# EAGLE design lofisampler (EAGLE 9.1.3)
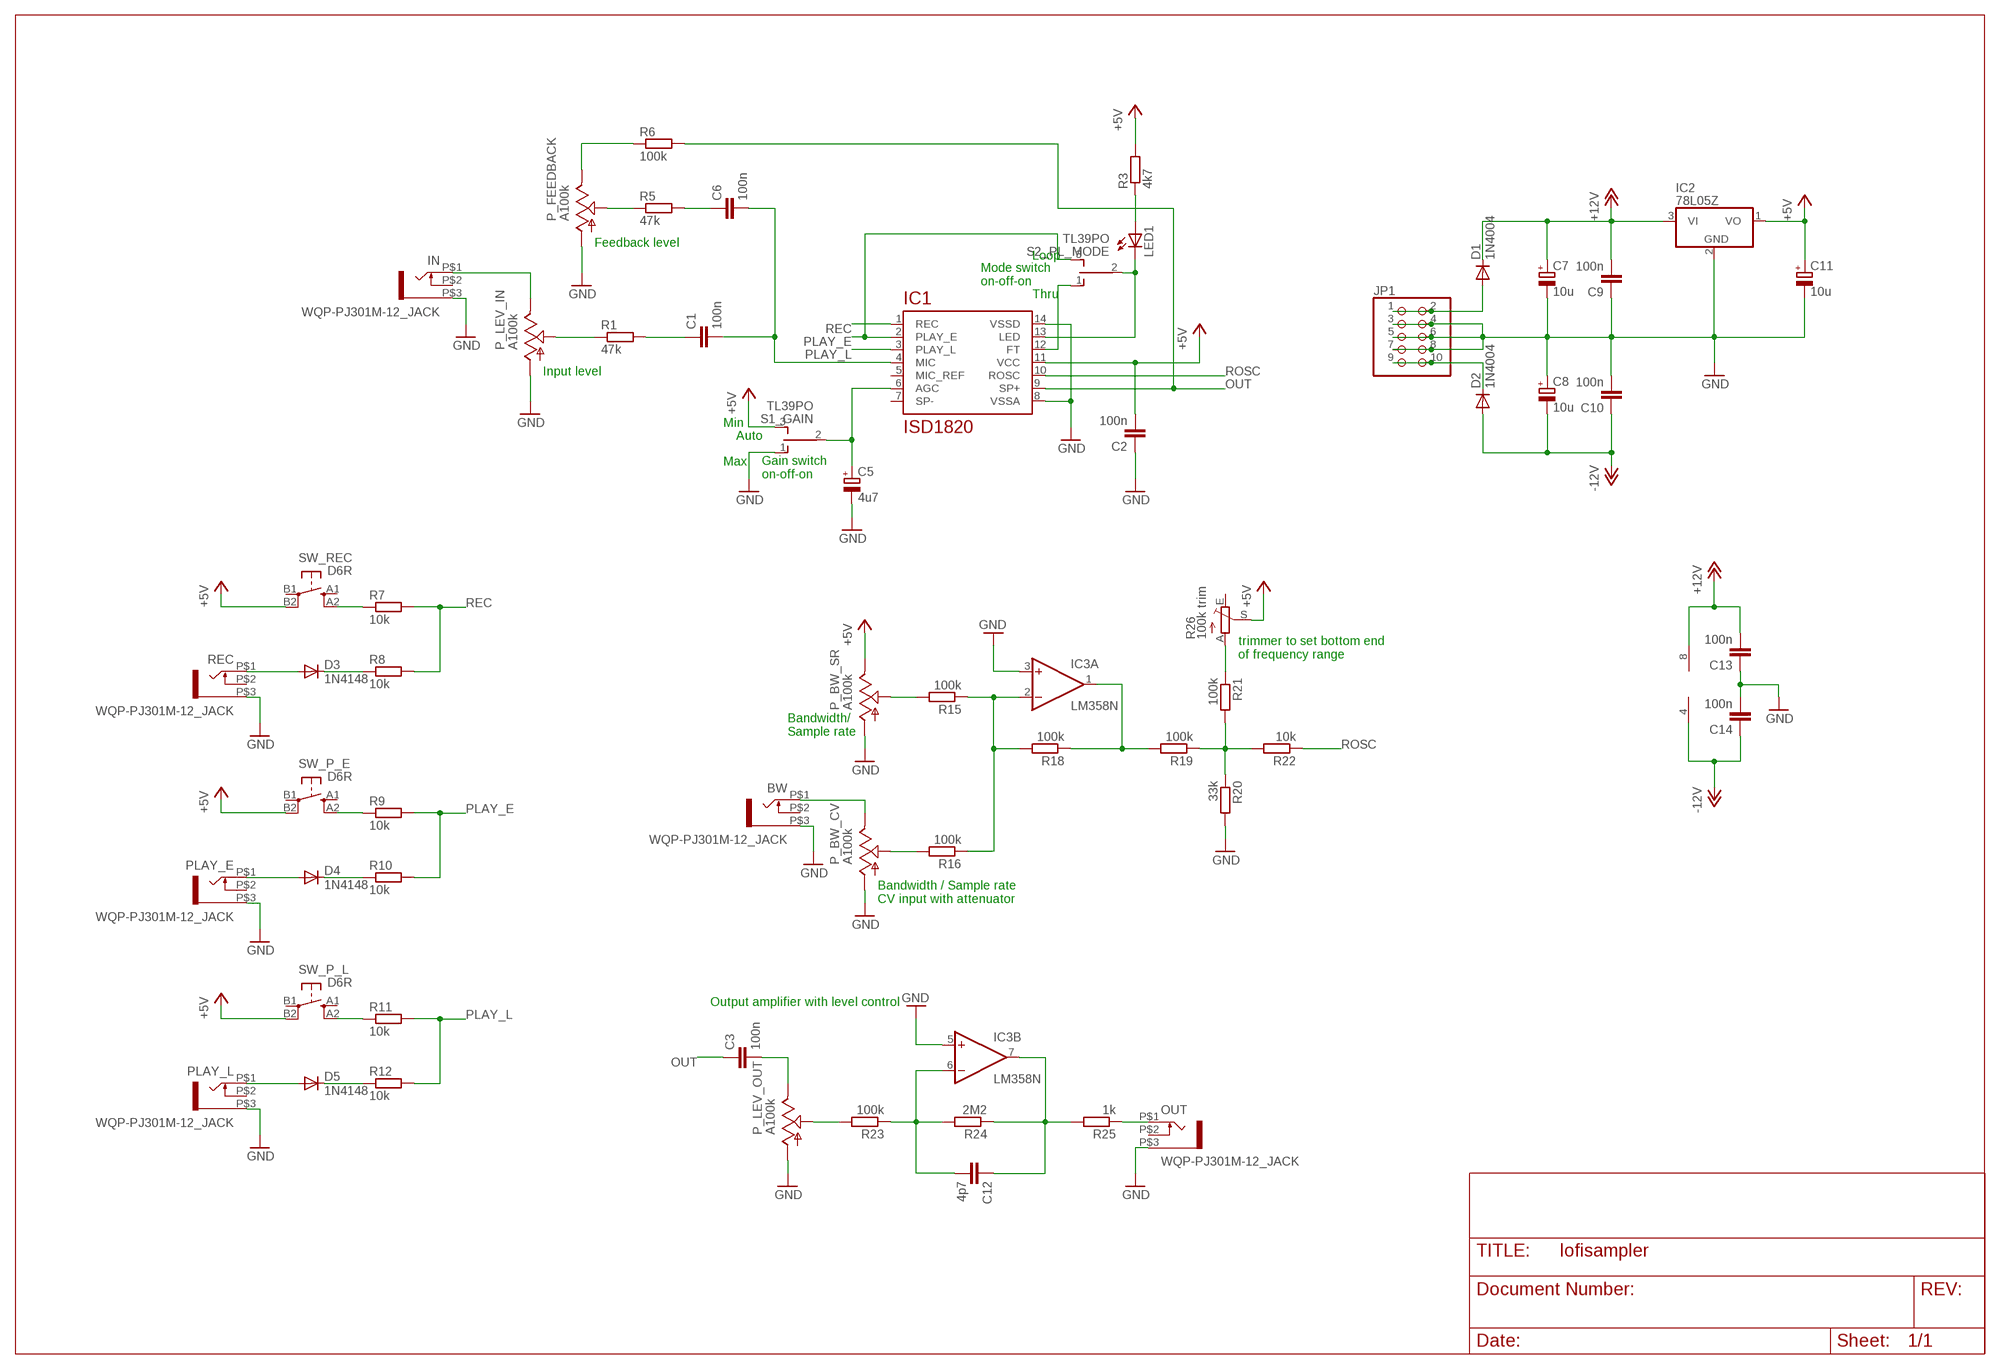
[diagram p0: schematic, sheet 1]

## Parts
BW  WQP-PJ301M-12_JACK  [WQP-PJ301M-12_JACK]
C1  100n  C-EU050-025X075  [C050-025X075]
C2  100n  C-EU025-025X050  [C025-025X050]
C3  100n  C-EU050-025X075  [C050-025X075]
C5  4u7  CPOL-EUE2.5-5  [E2,5-5]
C6  100n  C-EU050-025X075  [C050-025X075]
C7  10u  CPOL-EUE2.5-5  [E2,5-5]
C8  10u  CPOL-EUE2.5-5  [E2,5-5]
C9  100n  C-EU025-025X050  [C025-025X050]
C10  100n  C-EU025-025X050  [C025-025X050]
C11  10u  CPOL-EUE2.5-5  [E2,5-5]
C12  4p7  C-EU025-025X050  [C025-025X050]
C13  100n  C-EU025-025X050  [C025-025X050]
C14  100n  C-EU025-025X050  [C025-025X050]
D1  1N4004  [DO41-10]
D2  1N4004  [DO41-10]
D3  1N4148  1N4148DO35-7  [DO35-7]
D4  1N4148  1N4148DO35-7  [DO35-7]
D5  1N4148  1N4148DO35-7  [DO35-7]
IC1  ISD1820  [DIL14]
IC2  78L05Z  [TO92]
IC3  LM358N  [DIL08]
IN  WQP-PJ301M-12_JACK  [WQP-PJ301M-12_JACK]
JP1  PINHD-2X5  [2X05]
LED1  LED5MM  [LED5MM]
OUT  WQP-PJ301M-12_JACK  [WQP-PJ301M-12_JACK]
P_BW_CV  A100k  POT_USVERTICAL  [ALPS_POT_VERTICAL]
P_BW_SR  A100k  POT_USVERTICAL  [ALPS_POT_VERTICAL]
P_FEEDBACK  A100k  POT_USVERTICAL  [ALPS_POT_VERTICAL]
P_LEV_IN  A100k  POT_USVERTICAL  [ALPS_POT_VERTICAL]
P_LEV_OUT  A100k  POT_USVERTICAL  [ALPS_POT_VERTICAL]
PLAY_E  WQP-PJ301M-12_JACK  [WQP-PJ301M-12_JACK]
PLAY_L  WQP-PJ301M-12_JACK  [WQP-PJ301M-12_JACK]
R1  47k  R-EU_0207/2V  [0207/2V]
R3  4k7  R-EU_0207/2V  [0207/2V]
R5  47k  R-EU_0207/2V  [0207/2V]
R6  100k  R-EU_0207/2V  [0207/2V]
R7  10k  R-EU_0207/2V  [0207/2V]
R8  10k  R-EU_0207/2V  [0207/2V]
R9  10k  R-EU_0207/2V  [0207/2V]
R10  10k  R-EU_0207/2V  [0207/2V]
R11  10k  R-EU_0207/2V  [0207/2V]
R12  10k  R-EU_0207/2V  [0207/2V]
R15  100k  R-EU_0207/2V  [0207/2V]
R16  100k  R-EU_0207/2V  [0207/2V]
R18  100k  R-EU_0207/2V  [0207/2V]
R19  100k  R-EU_0207/2V  [0207/2V]
R20  33k  R-EU_0207/2V  [0207/2V]
R21  100k  R-EU_0207/2V  [0207/2V]
R22  10k  R-EU_0207/2V  [0207/2V]
R23  100k  R-EU_0207/2V  [0207/2V]
R24  2M2  R-EU_0207/2V  [0207/2V]
R25  1k  R-EU_0207/2V  [0207/2V]
R26  100k trim  TRIM_EU-B25P  [B25P]
REC  WQP-PJ301M-12_JACK  [WQP-PJ301M-12_JACK]
S1_GAIN  TL39PO  [TL3XPO]
S2_PL_MODE  TL39PO  [TL3XPO]
SW_P_E  D6R  [D6R]
SW_P_L  D6R  [D6R]
SW_REC  D6R  [D6R]

## Nets
+5V: C2.2 C11.+ IC1.11(VCC) IC2.1(VO) P_BW_SR.P$1(E) R3.2 R26.S S1_GAIN.3(S) SW_P_E.B2(P1) SW_P_L.B2(P1) SW_REC.B2(P1)
+12V: C7.+ C9.2 C13.2 D1.C IC2.3(VI) IC3.8(P:V+)
-12V: C8.- C10.1 C14.1 D2.A IC3.4(P:V-)
GND: BW.P$3 C2.1 C5.- C7.- C8.+ C9.1 C10.2 C11.- C13.1 C14.2 IC1.8(VSSA) IC1.14(VSSD) IC2.2(GND) IC3.3(A:+IN) IC3.5(B:+IN) IN.P$3 JP1.3 JP1.4 JP1.5 JP1.6 JP1.7 JP1.8 OUT.P$3 P_BW_CV.P$3(A) P_BW_SR.P$3(A) P_FEEDBACK.P$3(A) P_LEV_IN.P$3(A) P_LEV_OUT.P$3(A) PLAY_E.P$3 PLAY_L.P$3 R20.2 REC.P$3 S1_GAIN.1(O)
N$1: IN.P$1 P_LEV_IN.P$1(E)
N$2: P_LEV_IN.P$2(S) R1.1
N$3: C1.1 R1.2
N$4: C1.2 C6.2 IC1.4(MIC)
N$5: LED1.A R3.1
N$6: IC1.13(LED) LED1.K(C) S2_PL_MODE.2(P)
N$7: IC1.12(FT) S2_PL_MODE.1(O)
N$8: P_FEEDBACK.P$1(E) R6.1
N$9: D1.A JP1.1 JP1.2
N$10: P_FEEDBACK.P$2(S) R5.1
N$11: C5.+ IC1.6(AGC) S1_GAIN.2(P)
N$12: C6.1 R5.2
N$13: D2.C JP1.9 JP1.10
N$14: R21.1 R26.A
N$15: C3.2 P_LEV_OUT.P$1(E)
N$16: P_LEV_OUT.P$2(S) R23.2
N$17: C12.2 IC3.6(B:-IN) R23.1 R24.2
N$18: D3.A REC.P$1
N$19: D3.C R8.1
N$20: P_BW_SR.P$2(S) R15.2
N$21: R7.1 SW_REC.A2(S1)
N$22: P_BW_CV.P$2(S) R16.2
N$23: D4.A PLAY_E.P$1
N$24: D4.C R10.1
N$25: IC3.2(A:-IN) R15.1 R16.1 R18.2
N$26: R9.1 SW_P_E.A2(S1)
N$27: D5.A PLAY_L.P$1
N$28: D5.C R12.1
N$29: C12.1 IC3.7(B:OUT) R24.1 R25.2
N$30: R11.1 SW_P_L.A2(S1)
N$31: IC3.1(A:OUT) R18.1 R19.2
N$32: BW.P$1 P_BW_CV.P$1(E)
N$33: R19.1 R20.1 R21.2 R22.2
N$36: OUT.P$1 R25.1
OUT: C3.1 IC1.9(SP+) R6.2
PLAY_E: IC1.2(PLAY_E) R9.2 R10.2 S2_PL_MODE.3(S)
PLAY_L: IC1.3(PLAY_L) R11.2 R12.2
REC: IC1.1(REC) R7.2 R8.2
ROSC: IC1.10(ROSC) R22.1
Unconnected: BW.P$2 IC1.5(MIC_REF) IC1.7(SP-) IN.P$2 OUT.P$2 PLAY_E.P$2 PLAY_L.P$2 R26.E REC.P$2 SW_P_E.A1(S) SW_P_E.B1(P) SW_P_L.A1(S) SW_P_L.B1(P) SW_REC.A1(S) SW_REC.B1(P)

## Notes on the sheet
- Feedback level
- Loop
- Mode switch
  on-off-on
- Thru
- Input level
- Min
- Auto
- Max
- Gain switch
  on-off-on
- trimmer to set bottom end
  of frequency range
- Bandwidth/
  Sample rate
- Bandwidth / Sample rate
  CV input with attenuator
- Output amplifier with level control

## Library data of the parts
BW IN OUT PLAY_E PLAY_L REC = thonkiconn:WQP-PJ301M-12_JACK
C1-C3 C6 C9 C10 C12-C14 = rcl:C-EU: CAPACITOR, European symbol; SPICEPREFIX: C
C5 C7 C8 C11 = rcl:CPOL-EU: POLARIZED CAPACITOR, European symbol; SPICEPREFIX: C
D1 D2 = diode:1N4004: DIODE general purpose rectifier, 1 A
D3-D5 = diode:1N4148: DIODE high speed (Philips)
IC1 = L71_devices:ISD1820: ISD1820 audio record and playback chip
IC2 = linear:78*: Positive VOLTAGE REGULATOR Source: http://cache.national.com/ds/LM/LM78L05.pdf http://www.fairchildsemi.com/ds/LM/LM7805.pdf
IC3 = linear:LM358: OP AMP also LM158; LM258; LM2904 Source: http://cache.national.com/ds/LM/LM158.pdf
JP1 = pinhead:PINHD-2X5: PIN HEADER
LED1 = led:LED: LED OSRAM: - CHIPLED LG R971, LG N971, LY N971, LG Q971, LY Q971, LO R971, LY R971 LH N974, LH R974 LS Q976, LO Q976, LY Q976 LO Q996 - Hyper CHIPLED LW Q18S LB Q993, LB Q99A, LB R99A - SideLED LS A670, LO A670, LY A670, LG A670, LP A670 LB A673, LV A673, LT A673, LW A673 LH A674 LY A675 LS A676, LA A676, LO A676, LY A676, LW A676 LS A679, LY A679, LG A679 - Hyper Micro SIDELED® LS Y876, LA Y876, LO Y876, LY Y876 LT Y87S - SmartLED LW L88C, LW L88S LB L89C, LB L89S, LG L890 LS L89K, LO L89K, LY L89K LS L896, LA L896, LO L896, LY L896 - TOPLED LS T670, LO T670, LY T670, LG T670, LP T670 LSG T670, LSP T670, LSY T670, LOP T670, LYG T670 LG T671, LOG T671, LSG T671 LB T673, LV T673, LT T673, LW T673 LH T674 LS T676, LA T676, LO T676, LY T676, LB T676, LH T676, LSB T676, LW T676 LB T67C, LV T67C, LT T67C, LS T67K, LO T67K, LY T67K, LW E67C LS E67B, LA E67B, LO E67B, LY E67B, LB E67C, LV E67C, LT E67C LW T67C LS T679, LY T679, LG T679 LS T770, LO T770, LY T770, LG T770, LP T770 LB T773, LV T773, LT T773, LW T773 LH T774 LS E675, LA E675, LY E675, LS T675 LS T776, LA T776, LO T776, LY T776, LB T776 LHGB T686 LT T68C, LB T68C - Hyper Mini TOPLED® LB M676 - Mini TOPLED Santana® LG M470 LS M47K, LO M47K, LY M47K Source: http://www.osram.convergy.de LUXEON: - LUMILED® LXK2-PW12-R00, LXK2-PW12-S00, LXK2-PW14-U00, LXK2-PW14-V00 LXK2-PM12-R00, LXK2-PM12-S00, LXK2-PM14-U00 LXK2-PE12-Q00, LXK2-PE12-R00, LXK2-PE12-S00, LXK2-PE14-T00, LXK2-PE14-U00 LXK2-PB12-K00, LXK2-PB12-L00, LXK2-PB12-M00, LXK2-PB14-N00, LXK2-PB14-P00, LXK2-PB14-Q00 LXK2-PR12-L00, LXK2-PR12-M00, LXK2-PR14-Q00, LXK2-PR14-R00 LXK2-PD12-Q00, LXK2-PD12-R00, LXK2-PD12-S00 LXK2-PH12-R00, LXK2-PH12-S00 LXK2-PL12-P00, LXK2-PL12-Q00, LXK2-PL12-R00 Source: www.luxeon.com KINGBRIGHT: KA-3528ASYC Source: www.kingbright.com
P_BW_CV P_BW_SR P_FEEDBACK P_LEV_IN P_LEV_OUT = pot-alps:POT_US
R1 R3 R5-R12 R15 R16 R18-R25 = rcl:R-EU_: RESISTOR, European symbol; SPICEPREFIX: R
R26 = pot:TRIM_EU-: POTENTIOMETER
S1_GAIN S2_PL_MODE = switch:TL39PO: TINY SWITCH ON OFF ON Source: http://www2.produktinfo.conrad.com/datenblaetter/700000-724999/705152-da-01-de-Subminiaturschalter_TL_36YO.pdf
SW_P_E SW_P_L SW_REC = og-switch-CK_D6R:D6R: C&K D6R

## Board
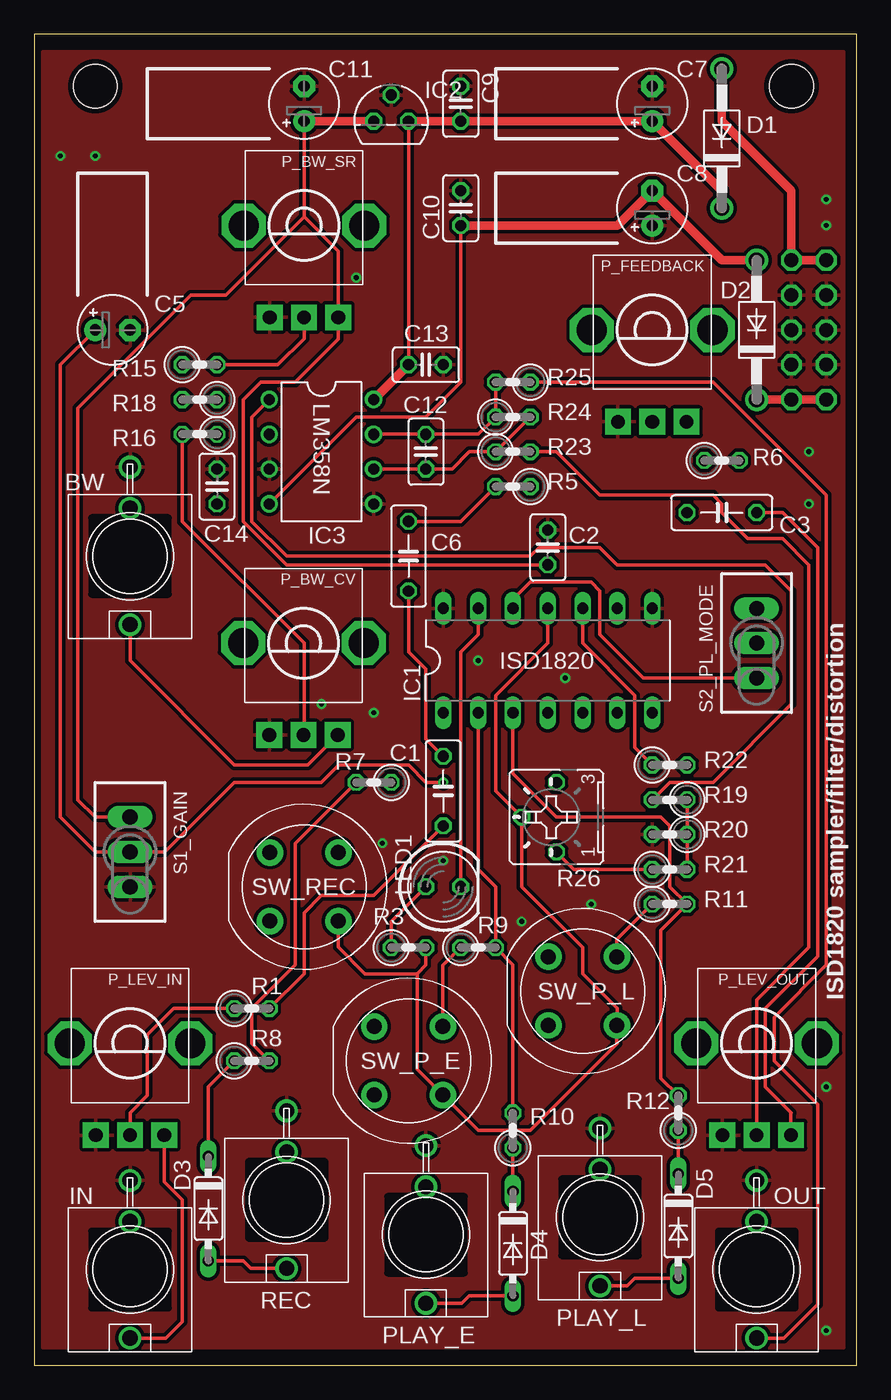
[diagram p1: board, top side]
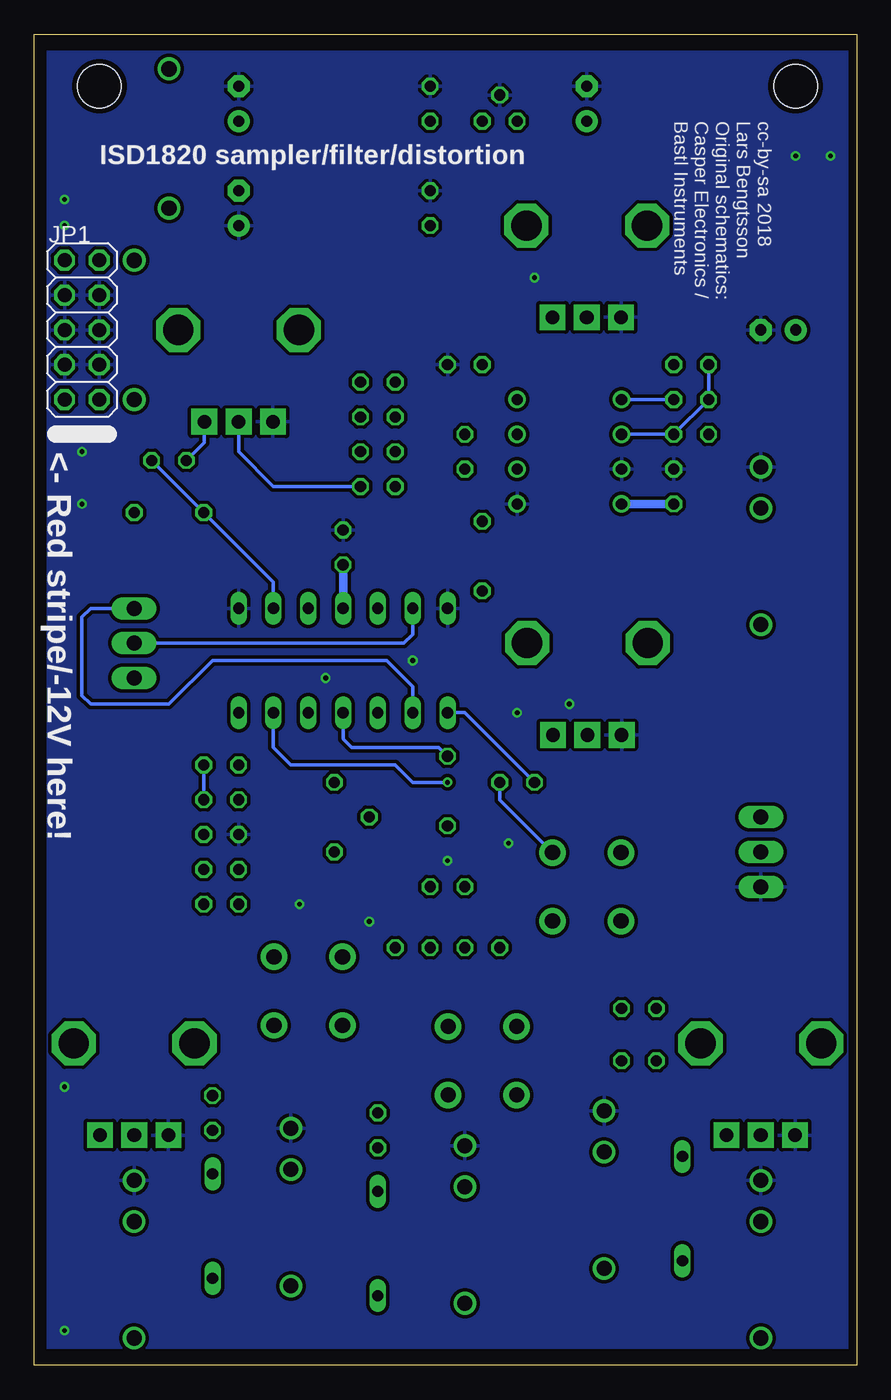
[diagram p2: board, bottom side, seen from below]

Size 60 x 97.14 mm. Coordinates in mm from the lower left corner, seen from the top.
Outline: 0,0 60,0 60,97.14 0,97.14 0,0
Copper layers (1*16): Top 0.0356mm / dielectric 1.5011mm / Bottom 0.0356mm
Design rules "Laen OSH Park PCBOrder": minimum track width 6mil, minimum drill 13mil, track to track 6mil, track to pad 6mil, pad to pad 6mil, via to via 6mil, smd to smd 6mil, copper to edge 15mil, drill to drill 6mil, minimum pad ring 7mil, minimum via ring 7mil, stop-mask expansion 3mil, vias tented up to drill 0mil, thermal gap 10mil
Holes 3.2 mm at 4.45,93.34 55.25,93.34

### Footprints (pad centres in the part's own frame; a part is rotated, then mirrored left to right if it is on the bottom)
WQP-PJ301M-12_JACK = drill 1.1: P$1 0,5; P$2 0,-3.5; P$3 0,-6.5
C050-025X075 = drill 0.813 octagon: 1 -2.54,0; 2 2.54,0
C025-025X050 = drill 0.813 octagon: 1 -1.27,0; 2 1.27,0
E2,5-5 = drill 0.813 pad 1.6: + -1.27,0 | drill 0.813 pad 1.6 octagon: - 1.27,0
DO41-10 = drill 1.118: A 5.08,0; C -5.08,0
DO35-7 = drill 0.813 long: A 3.81,0; C -3.81,0
DIL14 = drill 0.813 long: 1 -7.62,-3.81; 2 -5.08,-3.81; 3 -2.54,-3.81; 4 0,-3.81; 5 2.54,-3.81; 6 5.08,-3.81; 7 7.62,-3.81; 8 7.62,3.81; 9 5.08,3.81; 10 2.54,3.81; 11 0,3.81; 12 -2.54,3.81; 13 -5.08,3.81; 14 -7.62,3.81
TO92 = drill 0.813 octagon: 1 -1.27,0; 2 0,1.905; 3 1.27,0
DIL08 = drill 0.813 pad 1.27: 1 -3.81,-3.81; 2 -1.27,-3.81; 3 1.27,-3.81; 4 3.81,-3.81; 5 3.81,3.81; 6 1.27,3.81; 7 -1.27,3.81; 8 -3.81,3.81
2X05 = drill 1.016 octagon: 1 -5.08,-1.27; 2 -5.08,1.27; 3 -2.54,-1.27; 4 -2.54,1.27; 5 0,-1.27; 6 0,1.27; 7 2.54,-1.27; 8 2.54,1.27; 9 5.08,-1.27; 10 5.08,1.27
LED5MM = drill 0.813 octagon: A -1.27,0; K 1.27,0
ALPS_POT_VERTICAL = drill 1 pad 1.88 square: P$1 -2.5,6.7; P$2 0,6.7; P$3 2.5,6.7 | drill 2.2 pad 3.175 octagon: P$4 -4.4,0; P$5 4.4,0
0207/2V = drill 0.813 octagon: 1 -1.27,0; 2 1.27,0
B25P = drill 0.813 octagon: A -2.54,0; E 2.54,0; S 0,2.54
TL3XPO = drill 1.1 pad 1.422 long: 1 -2.54,0; 2 0,0; 3 2.54,0
D6R = drill 1.1 pad 1.93: A1 -2.5,2.5; A2 2.5,2.5; B1 -2.5,-2.5; B2 2.5,-2.5

### Placement (x,y rotation side)
BW  6.99,59.05 180 top
C1  29.84,41.91 90 top
C2  37.47,59.69 270 top
C3  50.16,62.23 0 top
C5  5.71,75.56 0 top
C6  27.3,59.05 270 top
C7  45.09,92.07 90 top
C8  45.09,84.45 90 top
C9  31.11,92.07 270 top
C10  31.11,84.45 90 top
C11  19.68,92.07 90 top
C12  28.57,66.67 270 top
C13  28.57,73.02 180 top
C14  13.34,64.13 90 top
D1  50.16,89.53 90 top
D2  52.71,75.56 90 top
D3  12.7,11.43 270 top
D4  34.93,8.89 270 top
D5  46.99,10.16 270 top
IC1  37.47,51.44 0 top
IC2  26.04,90.8 0 top
IC3  20.95,66.67 270 top
IN  6.99,6.99 180 top
JP1  56.52,75.56 270 bottom
LED1  29.84,34.93 0 top
OUT  52.71,6.99 180 top
P_BW_CV  19.64,52.71 180 top
P_BW_SR  19.68,83.18 180 top
P_FEEDBACK  45.09,75.56 180 top
P_LEV_IN  6.99,23.49 180 top
P_LEV_OUT  52.71,23.49 180 top
PLAY_E  28.57,9.53 180 top
PLAY_L  41.27,10.79 180 top
R1  15.88,26.04 0 top
R3  27.3,30.48 0 top
R5  34.93,64.13 180 top
R6  50.16,66.04 0 top
R7  24.76,42.55 180 top
R8  15.88,22.22 0 top
R9  32.39,30.48 0 top
R10  34.93,17.14 90 top
R11  46.36,33.66 0 top
R12  46.99,18.41 90 top
R15  12.06,73.02 0 top
R16  12.06,67.94 180 top
R18  12.06,70.48 180 top
R19  46.36,41.27 180 top
R20  46.36,38.73 180 top
R21  46.36,36.2 0 top
R22  46.36,43.82 0 top
R23  34.93,66.67 0 top
R24  34.93,69.21 0 top
R25  34.93,71.75 180 top
R26  38.1,40.01 90 top
REC  18.41,12.06 180 top
S1_GAIN  6.99,37.47 90 top
S2_PL_MODE  52.71,52.71 90 top
SW_P_E  27.3,22.22 0 top
SW_P_L  40.01,27.3 0 top
SW_REC  19.68,34.93 0 top

### Tracks (layer width: path | path; a pad name or v marks a point on that pad's centre or on a via)
+5V
  Top 0.254: IC1.11 37.47,52.71 33.66,48.9 33.66,41.91 R26.S 35.56,34.93 40.01,30.48 40.01,28.57 42.55,26.04 42.55,24.84 SW_P_L.B2 42.51,23.54 42.55,23.49 36.2,17.14 32.39,17.14 SW_P_E.B2 27.94,21.59 27.94,28.57 | R3.2 28.57,29.21 27.94,28.57 | SW_REC.B2 22.18,30.52 24.13,28.57 27.94,28.57 | C2.2 18.41,58.42 15.24,61.59 15.24,70.48 16.51,71.75 19.05,71.75 22.18,74.89 P_BW_SR.P$1 22.18,81.32 19.68,83.82 | 19.68,83.82 13.97,78.1 11.43,78.1 3.17,69.85 3.17,41.27 4.45,40.01 S1_GAIN.3 | 19.68,83.82 C11.+
  Top 0.61: IC2.1 C11.+
  Bottom 0.61: IC1.11 C2.2
+12V
  Top 0.254: C13.2 IC2.3
  Top 0.61: D1.C 50.16,85.72 C7.+ C9.2 IC2.3 | IC3.8 C13.2
-12V
  Top 0.254: C10.1 31.11,71.75 28.57,69.21 23.49,69.21 IC3.4
  Top 0.61: D2.A 50.16,80.64 C8.- 42.55,83.18 C10.1
  Bottom 0.61: IC3.4 C14.1
GND  (via drill 0.35)
  other vias: 24.76,47.62 23.49,79.38 20.95,48.26 35.56,32.39 57.79,20.32 57.79,2.54 32.39,51.44 38.73,50.16 25.4,38.1 40.64,33.66 29.84,36.83 56.52,66.67 4.45,88.27 57.79,85.09 1.91,88.27 57.79,83.18 56.52,62.87
  pour Bottom (isolate 0.254): 0.64,95.88 59.05,95.88 59.05,1.27 0.64,1.27
  pour Top (isolate 0.254): 0.64,95.88 59.05,95.88 59.05,1.91 59.05,1.27 0.64,1.27
N$1
  Top 0.254: IN.P$1 9.61,1.99 10.79,3.17 10.79,12.06 9.48,13.38 P_LEV_IN.P$1
N$2
  Top 0.254: P_LEV_IN.P$2 6.99,18.41 8.26,19.68 8.26,24.13 10.16,26.04 R1.1
N$3
  Top 0.254: C1.1 24.76,34.29 20.95,34.29 19.68,33.02 19.68,28.57 R1.2
N$4
  Top 0.254: C1.2 28.57,45.72 28.57,50.8 27.3,52.07 C6.2
  Bottom 0.254: IC1.4 37.47,45.72 36.83,45.09 30.48,45.09 C1.2
N$5
  Top 0.254: LED1.A 26.04,32.39 R3.1
N$6
  Top 0.254: LED1.K 31.11,52.07 32.39,53.34 IC1.13
  Bottom 0.254: S2_PL_MODE.2 33.02,52.71 32.39,53.34 IC1.13
N$7
  Top 0.254: IC1.12 34.93,55.88 36.2,57.15 40.64,57.15 41.27,56.52 41.27,53.34 44.45,50.16 S2_PL_MODE.1
N$8
  Bottom 0.254: P_FEEDBACK.P$1 47.59,67.35 R6.1
N$9
  Top 0.61: JP1.1 JP1.2 55.25,85.72 50.16,90.8 D1.A
N$10
  Bottom 0.254: R5.1 42.55,64.13 45.09,66.67 P_FEEDBACK.P$2
N$11  (via drill 0.35)
  Top 0.254: v29.84,42.55 28.57,42.55 27.3,43.82 22.22,43.82 20.95,42.55 14.61,42.55 9.53,37.47 S1_GAIN.2 4.45,37.47 1.91,40.01 1.91,73.02 C5.+
  Bottom 0.254: IC1.6 42.55,45.09 41.27,43.82 33.66,43.82 32.39,42.55 v29.84,42.55
N$12
  Top 0.254: R5.2 31.11,61.59 C6.1
N$13
  Top 0.61: JP1.9 JP1.10 D2.C
N$14
  Top 0.254: R26.A 39.37,36.2 R21.1
N$15
  Top 0.254: P_LEV_OUT.P$1 55.21,18.38 55.25,18.41 53.34,20.32 53.34,26.04 57.15,29.84 57.15,59.69 54.61,62.23 C3.2
N$16
  Top 0.254: P_LEV_OUT.P$2 52.71,26.67 56.52,30.48 56.52,58.42 54.61,60.33 52.07,60.33 50.16,62.23 50.16,62.87 49.53,63.5 41.27,63.5 38.1,66.67 R23.2
N$17
  Top 0.254: IC3.6 C12.2 30.48,65.41 31.75,66.67 R23.1 R24.2
N$18
  Top 0.254: REC.P$1 15.79,7.07 15.24,7.62 D3.A
N$19
  Top 0.254: D3.C 12.7,20.32 R8.1
N$20
  Top 0.254: P_BW_SR.P$2 19.68,74.93 17.78,73.02 R15.2
N$21
  Bottom 0.254: SW_REC.A2 26.04,41.27 R7.1
N$22
  Top 0.254: R16.2 10.79,61.59 19.68,52.71 19.68,46.05 P_BW_CV.P$2
N$23
  Top 0.254: PLAY_E.P$1 31.19,4.53 31.75,5.08 D4.A
N$24
  Top 0.254: R10.1 D4.C
N$25
  Bottom 0.254: IC3.2 R16.1 R18.2 R15.1
N$26
  Top 0.254: SW_P_E.A2 29.8,29.17 R9.1
N$27
  Top 0.254: PLAY_L.P$1 43.26,5.79 43.82,6.35 D5.A
N$28
  Top 0.254: R12.1 D5.C
N$29
  Top 0.254: IC3.7 C12.1 32.39,67.94 R24.1 R25.2
N$30
  Top 0.254: R11.1 42.51,31.07 SW_P_L.A2
N$31
  Top 0.254: IC3.1 15.88,69.21 15.88,61.59 18.41,59.05 36.2,59.05 36.83,59.69 41.27,59.69 42.55,58.42 53.34,58.42 55.25,56.52 55.25,48.26 49.53,42.55 46.36,42.55 R19.2
  Bottom 0.254: IC3.1 R18.1
N$32
  Top 0.254: P_BW_CV.P$1 19.95,43.82 14.61,43.82 6.99,51.44 BW.P$1
N$33
  Top 0.254: R19.1 R20.1 R21.2
  Bottom 0.254: R22.2 R19.1
N$36
  Top 0.254: OUT.P$1 54.69,1.99 57.15,4.45 57.15,19.05 53.98,22.22 53.98,25.4 57.79,29.21 57.79,63.5 49.53,71.75 R25.1
OUT
  Bottom 0.254: IC1.9 42.55,57.15 C3.1 R6.2
PLAY_E
  Top 0.254: R10.2 34.93,29.21 R9.2 33.66,34.93 32.39,36.2 IC1.2
  Bottom 0.254: S2_PL_MODE.3 55.88,55.25 56.52,54.61 56.52,48.9 55.88,48.26 50.16,48.26 46.99,51.44 34.29,51.44 32.39,49.53 IC1.2
PLAY_L
  Top 0.254: R12.2 45.72,20.95 45.72,31.75 R11.2 46.36,34.93 46.36,39.37 45.72,40.01 38.1,40.01 34.93,43.18 IC1.3
REC
  Top 0.254: R8.2 15.88,23.49 15.88,26.04 19.05,29.21 19.05,38.1 R7.2
  Bottom 0.254: R7.2 28.57,47.62 IC1.1
ROSC
  Top 0.254: R22.1 43.82,45.09 43.82,48.9 40.01,52.71 IC1.10

### Text on the board
tPlace: ISD1820 sampler/filter/distortion
bPlace: cc-by-sa 2018 / Lars Bengtsson / Original schematics: / Casper Electronics / / Bastl Instruments | ISD1820 sampler/filter/distortion | <- Red stripe/-12V here!